# EasyEDA Pro project 磁感应板.eprj

# Schematic Schematic1
Create Date: 2023-02-28; Page Name: P1; Project Name: 磁感应板; Schematic Name: Schematic1; Update Date: 2023-03-24
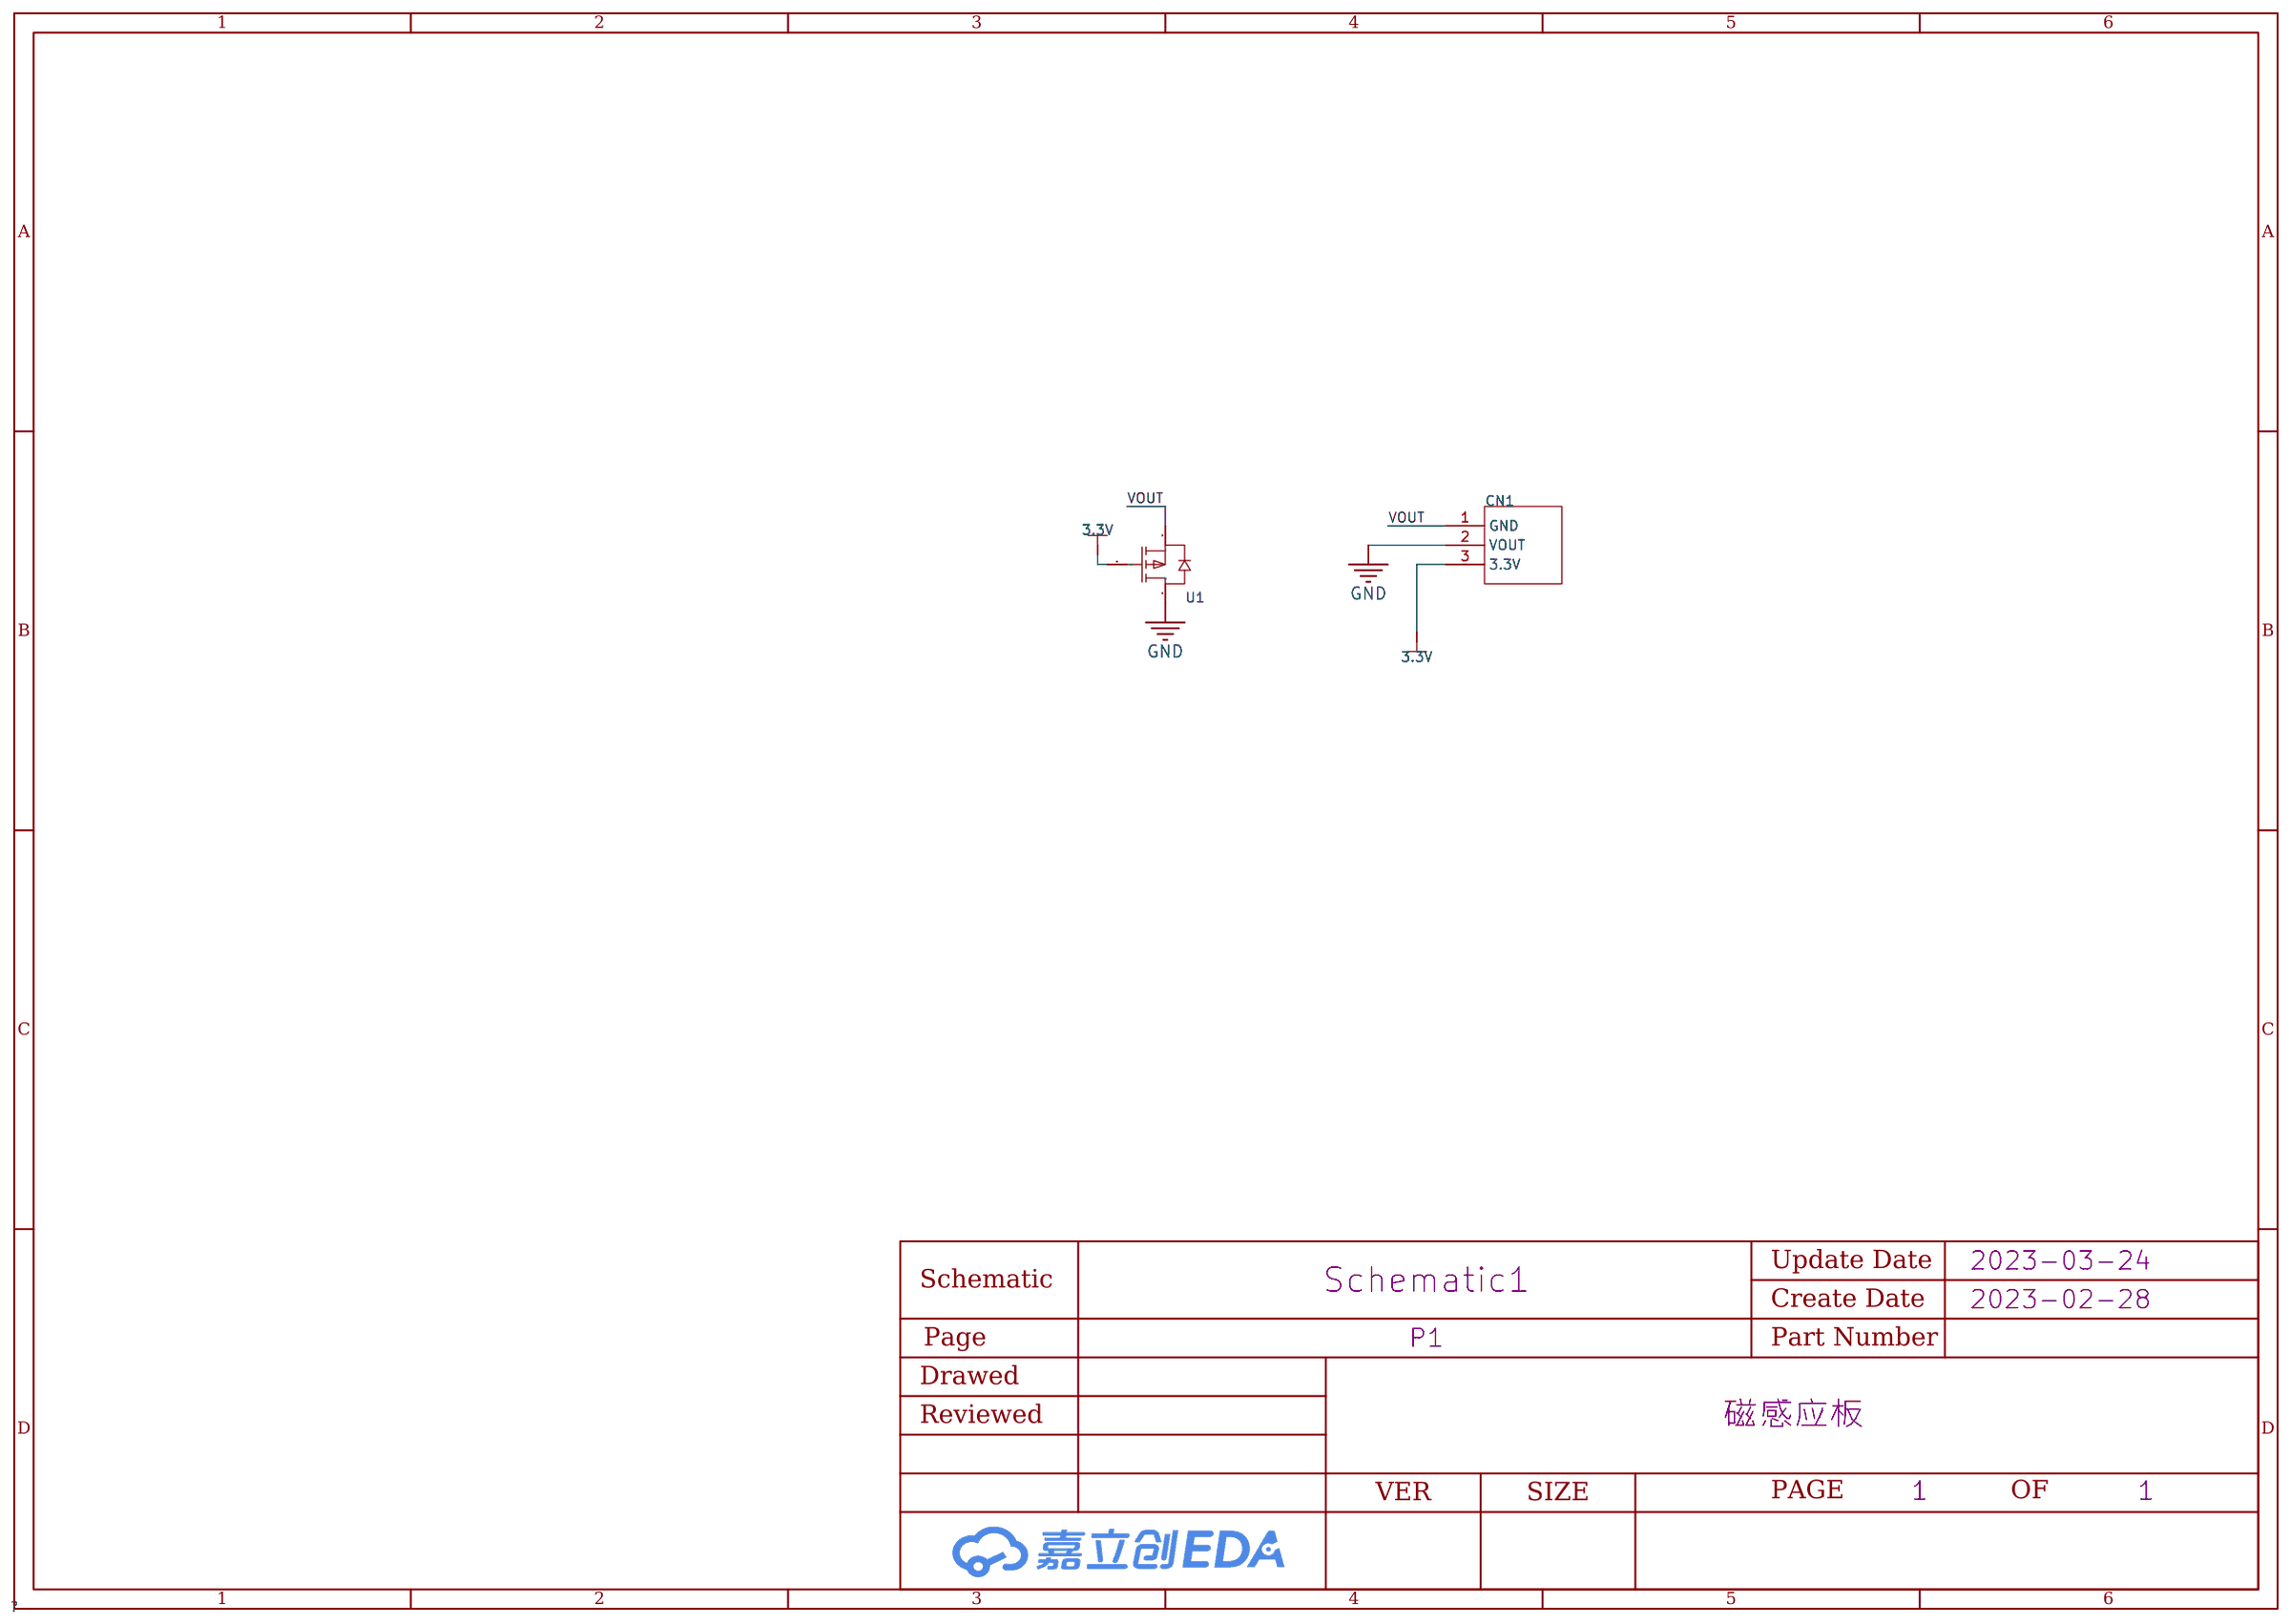
[diagram p0: schematic sheet]

## Parts
CN1  -  [3POINT]
U1  Si2309CDS-T1-GE3  [SOT-23_L2.9-W1.3-P1.90-LS2.4-BR]

## Library data of the parts
CN1 = 3POINT
U1 = Si2309CDS-T1-GE3_C10493: 类型:P沟道;漏源电压(Vdss):60V;连续漏极电流(Id):1.6A;功率(Pd):1W;导通电阻(RDS(on)@Vgs,Id):345mΩ@10V,1.25A;阈值电压(Vgs(th)@Id):3V@250uA;; LCSC Part Name: P沟道 60V 1.6A; Supplier Part: C10493; Manufacturer: VISHAY(威世); Supplier Footprint: SOT-23; JLCPCB Part Class: Extended Part; Datasheet: https://atta.szlcsc.com/upload/public/pdf/source/20121215/1457706568285.pdf; Supplier: LCSC; Type: P沟道; Drain Source Voltage (Vdss): 60V; Continuous Drain Current (Id): 1.6A; Power Dissipation (Pd): 1W; Drain Source On Resistance (RDS(on)@Vgs,Id): 345mΩ@10V,1.25A; Gate Threshold Voltage (Vgs(th)@Id): 3V@250uA

## Nets
3.3V: CN1.3(3.3V) U1.1(G)
GND: CN1.2(VOUT) U1.3(D)
VOUT: CN1.1(GND) U1.2(S)

# Board PCB1
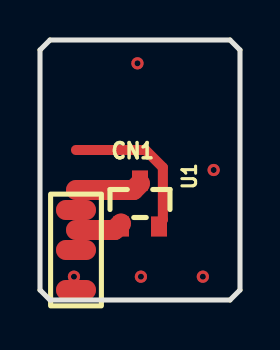
[diagram p1: board, top side]
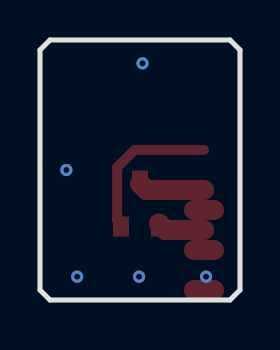
[diagram p2: board, bottom side, seen from below]

Outline 10 x 13 mm; copper layers: Top Layer, Bottom Layer. Coordinates in mm from the lower left corner of the outline.
Outline path: 0,12.5 0,0.5 0.5,0 9.5,0 10,0.5 10,12.5 9.5,13 0.5,13 0,12.5
Stack: Top Layer 0.035mm / Dielectric1 1.51mm FR4 er 4.5 / Bottom Layer 0.035mm

## Design rules (mm)
spacing safeClearance (default): track to track 0.152, other pairs 0.152 to 0.3
track width trackWidth (default): min 0.127, default 0.254, max 2.54
differential pair differentialPair (default): width min 0.127, default 0.254, max 2.54; gap min 0.152, default 0.152
via viaSize (default): diameter min 0.5, default 0.61, max 10; hole min 0.3, default 0.305, max 6

## Placement (name value [footprint] x y rotation side)
CN1  -  [3POINT]  1.8 5.5 270 top
U1  Si2309CDS-T1-GE3  [SOT-23_L2.9-W1.3-P1.90-LS2.4-BR]  5 4.83 270 top

## Footprints (pads in the part's own frame, mm; a bottom-side part is the same pattern mirrored in y, then rotated)
3POINT
  oval 1x2 smd: 1(1,0) 2(3,0) 3(5,0)
SOT-23_L2.9-W1.3-P1.90-LS2.4-BR
  rect 1x0.8 smd: 1(1.15,-0.95) 2(1.15,0.95) 3(-1.15,0)

## Nets
As in the schematic.

## Via types
v1: diameter 0.61, hole 0.305, Top Layer to Bottom Layer, 5 vias

## Routing (per net, layer and track width the routed paths; a pad name or vN(x,y) marks a point on that pad's centre or on a via; arc(x,y) is an arc through that point)
3.3V: length 2.4
  Top Layer w1: 1.8,3.5 3.72,3.5 4.05,3.83
GND: length 3.3
  Top Layer w1: 1.8,5.5 4.68,5.5 5,5.83
  vias: v1(1.7,1.17) v1(4.87,11.83) v1(5.05,1.17) v1(8.14,1.17) v1(8.68,6.5)
VOUT: length 7.6
  Top Layer w0.5: 5.95,3.83 6.14,4.02 6.14,6.63 5.27,7.5 1.8,7.5

## Copper pours and planes (outline as drawn; the poured copper is in the pictures)
GND on Top Layer: -0.03,13 9.95,13 9.95,0.02 -0.03,0.02
GND on Bottom Layer: -0.03,13 9.95,13 9.95,0.02 -0.03,0.02
